# Altium schematic sheet loraModule.SchDoc
size A3
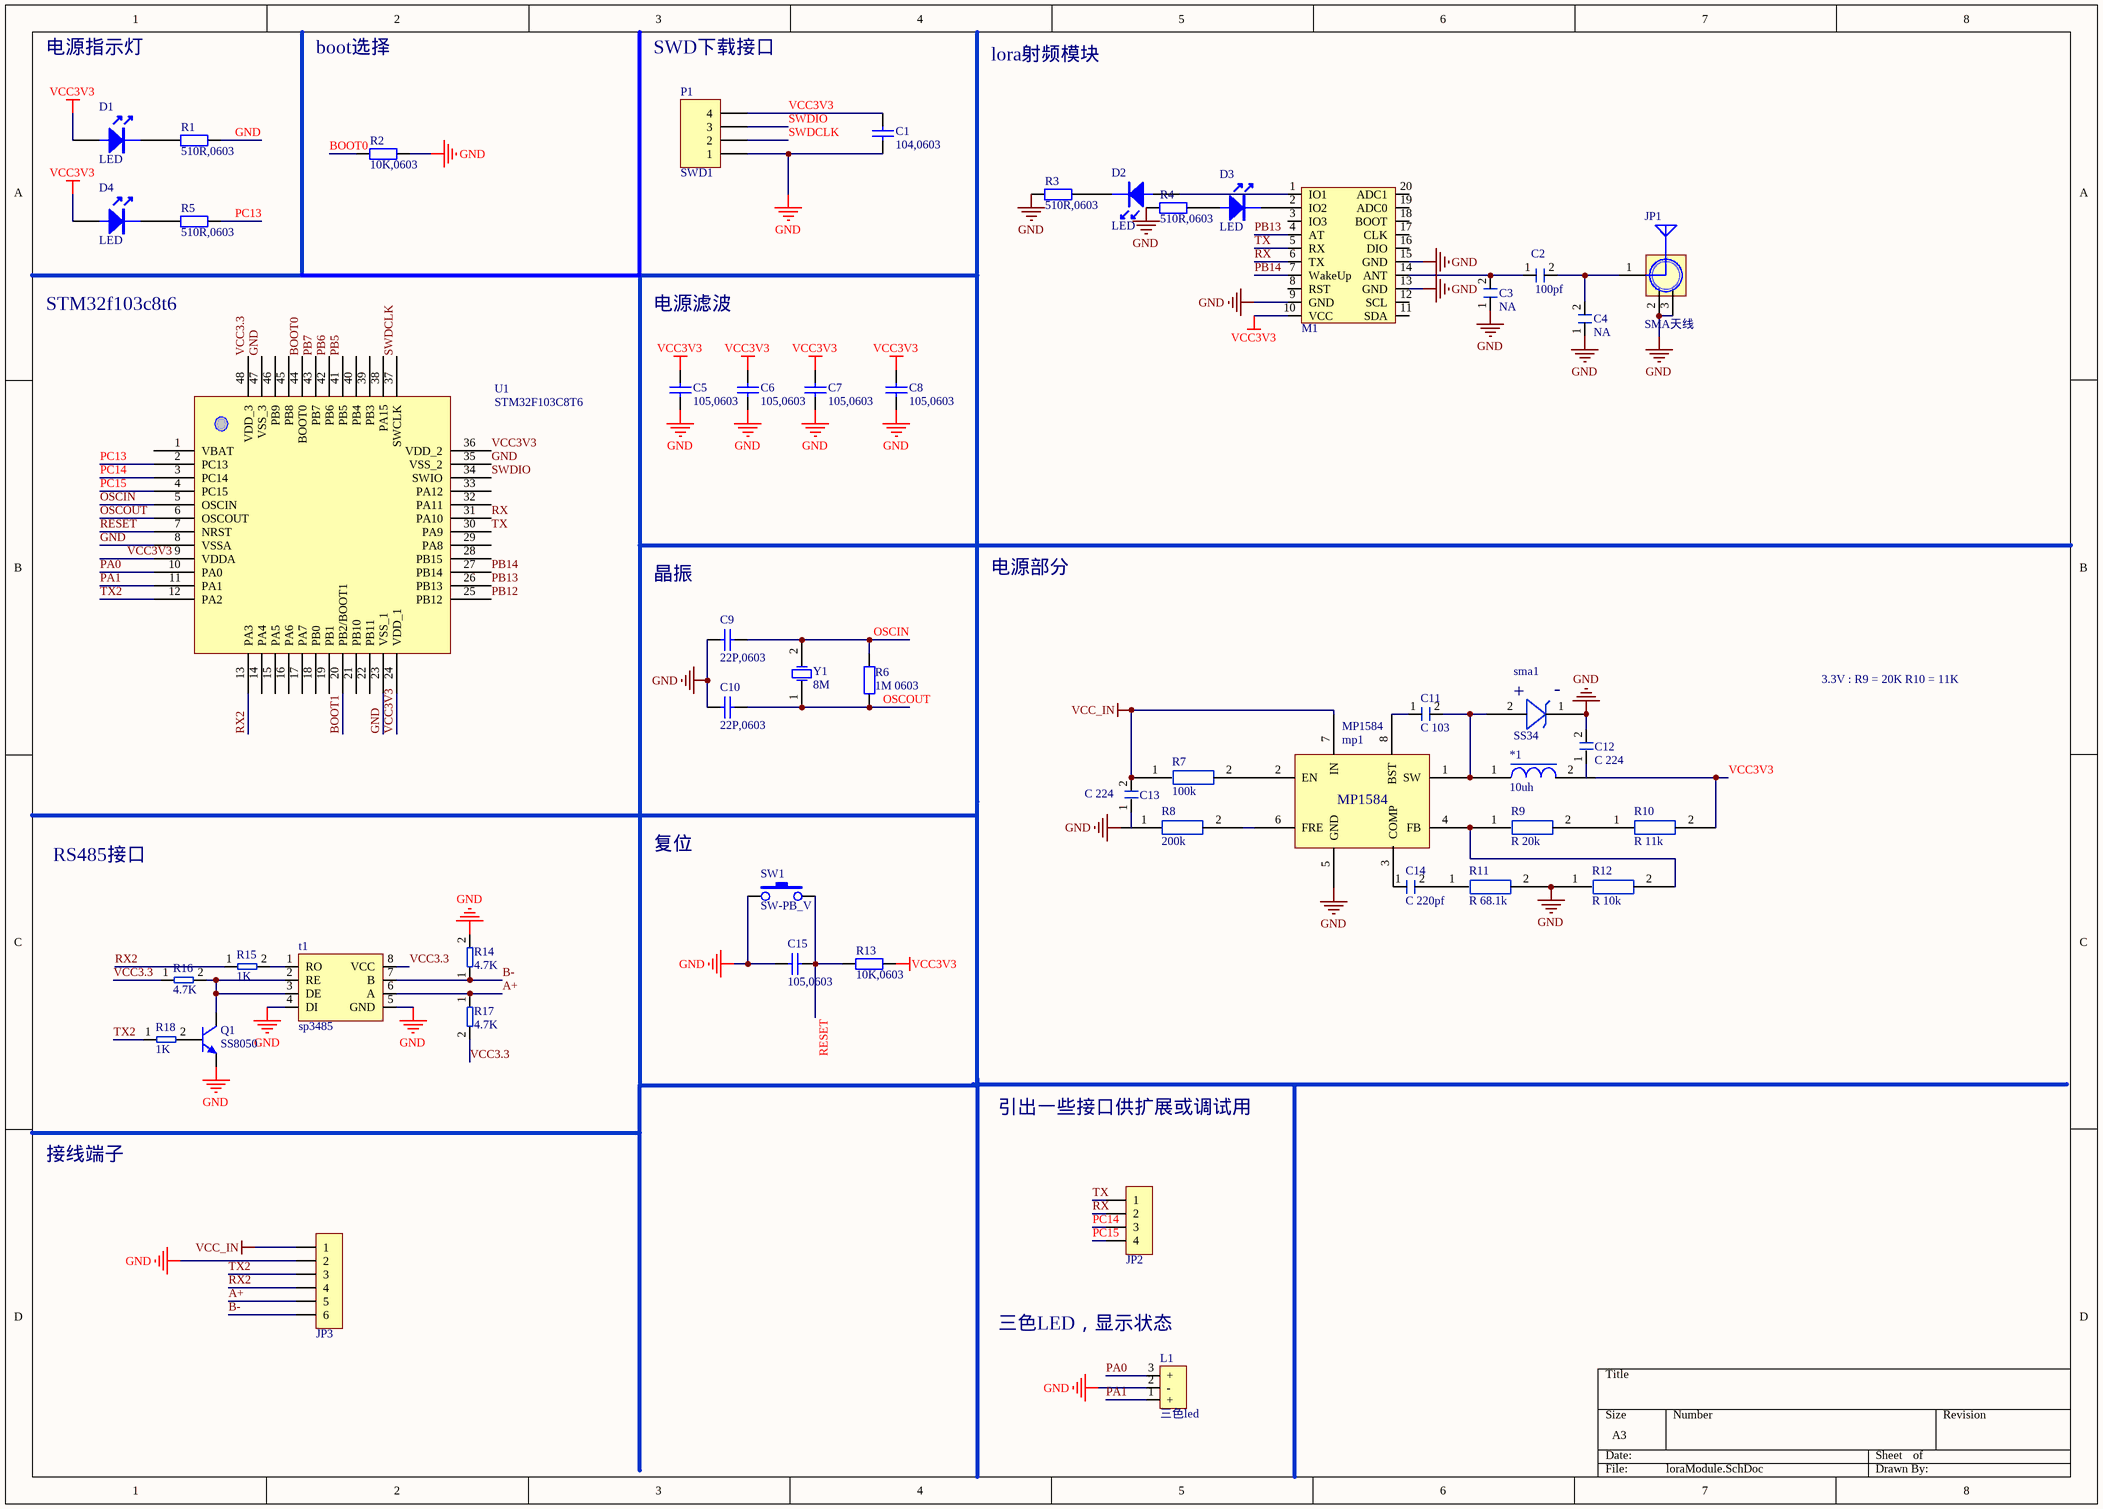
[diagram p0: loraModule.SchDoc]

## Parts
*1  10uh  [inductance]
C1  104,0603  [C 0603]
C2  100pf  [C 0603]
C3  NA  [C 0603]
C4  NA  [C 0603]
C5  105,0603  [C 0603]
C6  105,0603  [C 0603]
C7  105,0603  [C 0603]
C8  105,0603  [C 0603]
C9  22P,0603  [C 0603]
C10  22P,0603  [C 0603]
C11  C 103  [C 0603]
C12  C 224  [C 1206]
C13  C 224  [C 1206]
C14  C 220pf  [C 0603]
C15  105,0603  [C 0603]
D1  LED  [LED 0805G]
D2  LED  [LED 0805G]
D3  LED  [LED 0805G]
D4  LED  [LED 0805G]
JP1  SMA天线  [SMA-KE-LI]
JP2  HDR-1X4  [XH2.54-WI-4P]  (value not drawn)
JP3  HDR-1X6  [XH-3.55]  (value not drawn)
L1  三色led  [三色led - duplicate]
M1  M-HL10  [M-HL10]  (value not drawn)
mp1  MP1584  [mp1584]
P1  SWD1  [HDR-1X4_H]
Q1  SS8050  [SOT-23]
R1  510R,0603  [R 0603]
R2  10K,0603  [R 0603]
R3  510R,0603  [R 0603]
R4  510R,0603  [R 0603]
R5  510R,0603  [R 0603]
R6  1M 0603  [R 0603]
R7  100k  [R 0603]
R8  200k  [R 0603]
R9  R 20k  [R 0603]
R10  R 11k  [R 0603]
R11  R 68.1k  [R 0603]
R12  R 10k  [R 0603]
R13  10K,0603  [R 0603]
R14  4.7K  [R 0805]
R15  1K  [R 0805]
R16  4.7K  [R 0805]
R17  4.7K  [R 0805]
R18  1K  [R 0805]
sma1  SS34  [SMA]
SW1  SW-PB_V  [TSW SMD-3*6*2.5]
t1  sp3485  [sp3485]
U1  STM32F103C8T6  [TQFP48 7x7_L]
Y1  8M  [XTAL-49S DIP]

## Nets
GND: C1.1 C3.1 C4.1 C5.1 C6.1 C7.1 C8.1 C9.2 C10.2 C12.2 C15.1 JP1.2(GND) JP1.3(GND) JP3.2 L1.2(-) M1.9(GND) M1.13(GND) M1.15(GND) mp1.5(GND) P1.1 Q1.2(E) R1.2 R2.2 R3.1 R4.1 R8.1 R11.2 R12.1 R14.2 sma1.1 SW1.1 t1.4(DI) t1.5(GND) U1.8(VSSA) U1.23(VSS_1) U1.35(VSS_2) U1.47(VSS_3)
VCC3V3: *1.2 C1.2 C5.2 C6.2 C7.2 C8.2 D1.1 D4.1 M1.10(VCC) P1.4 R10.2 R13.2 U1.9(VDDA) U1.24(VDD_1) U1.36(VDD_2)
VCC_IN: C13.2 JP3.1 mp1.7(IN) R7.1
A+: JP3.5 R17.1 t1.6(A)
B-: JP3.6 R14.1 t1.7(B)
BOOT0: R2.1 U1.44(BOOT0)
BOOT1: U1.20(PB2/BOOT1)
OSCIN: C9.1 R6.2 U1.5(OSCIN) Y1.2(OSC2)
OSCOUT: C10.1 R6.1 U1.6(OSCOUT) Y1.1(OSC1)
PA0: L1.3(+) U1.10(PA0)
PA1: L1.1(+) U1.11(PA1)
PB5: U1.41(PB5)
PB6: U1.42(PB6)
PB7: U1.43(PB7)
PB12: U1.25(PB12)
PB13: M1.4(AT) U1.26(PB13)
PB14: M1.7(WakeUp) U1.27(PB14)
PC13: R5.2 U1.2(PC13)
PC14: JP2.3 U1.3(PC14)
PC15: JP2.4 U1.4(PC15)
RESET: C15.2 R13.1 SW1.2 U1.7(NRST)
RX: JP2.2 M1.6(TX) U1.31(PA10)
RX2: JP3.4 R15.1 U1.13(PA3)
SWDCLK: P1.2 U1.37(SWCLK)
SWDIO: P1.3 U1.34(SWIO)
TX: JP2.1 M1.5(RX) U1.30(PA9)
TX2: JP3.3 R18.1 U1.12(PA2)
VCC3.3: R16.1 R17.2 t1.8(VCC) U1.48(VDD_3)
Net*1_1: *1.1 C11.2 mp1.1(SW) sma1.2
NetC2_1: C2.1 C3.2 M1.14(ANT)
NetC2_2: C2.2 C4.2 JP1.1(ANT)
NetC11_1: C11.1 mp1.8(BST)
NetC14_1: C14.1 mp1.3(COMP)
NetC14_2: C14.2 R11.1
NetD1_2: D1.2 R1.1
NetD2_1: D2.1 M1.1(IO1)
NetD2_2: D2.2 R3.2
NetD3_2: D3.2 M1.2(IO2)
NetD4_2: D4.2 R5.1
Netmp1_2: mp1.2(EN) R7.2
Netmp1_4: mp1.4(FB) R9.1 R12.2
Netmp1_6: mp1.6(FRE) R8.2
NetQ1_1: Q1.1(B) R18.2
NetQ1_3: Q1.3(C) R16.2 t1.2(RE) t1.3(DE)
NetR9_2: R9.2 R10.1
NetR15_2: R15.2 t1.1(RO)

Not connected (* = marked no-connect by the designer): C12 1; C13 1; D3 1; M1 3(IO3) 8(RST) 11(SDA) 12(SCL) 16(DIO) 17(CLK) 18(BOOT) 19(ADC0) 20(ADC1); R4 2; U1 1(VBAT) 14(PA4) 15(PA5) 16(PA6) 17(PA7) 18(PB0) 19(PB1) 21(PB10) 22(PB11) 28(PB15) 29(PA8) 32(PA11) 33(PA12) 38(PA15) 39(PB3) 40(PB4) 45(PB8) 46(PB9)

## Notes on the sheet
- 电源指示灯
- boot选择
- SWD下载接口
- lora射频模块
- STM32f103c8t6
- 电源滤波
- 晶振
- 电源部分
- 3.3V : R9 = 20K R10 = 11K
- 复位
- RS485接口
- 引出一些接口供扩展或调试用
- 接线端子
- 三色LED，显示状态
- (in symbol s?) +; -

## Library data of the parts
*1 = inductance
C1 C5-C10 C15 = Cap: Capacitor; Value: 104; Published: 8-Jun-2000; LatestRevisionDate: 17-Jul-2002; LatestRevisionNote: Re-released for DXP Platform.; Publisher: Altium Limited
C2-C4 C11 C14 = C 0603
C12 C13 = C 1206
JP1 = SMA: SMA-2.4G射频天线接口; 版权归属: 源创客; BOM名称: SMA-2.4G射频天线接口; 学习资源: www.ooocke.com
JP2 = Header 4: 4P接插件; 版权归属: 源创客; BOM名称: 4P接插件; 学习资源: www.ooocke.com
JP3 = Header 6: 6P接插件; 版权归属: 源创客; BOM名称: 6P接插件; 学习资源: www.ooocke.com
mp1 = M?
P1 = Header 4: Header, 4-Pin; LatestRevisionDate: 17-Jul-2002; LatestRevisionNote: Re-released for DXP Platform.; Publisher: Altium Limited
Q1 = 8050-SMD: 高频放大-NPN型; 版权归属: 源创客; 属性: 40V 1.5A 1W 100MHZ; BOM名称: 高频放大-NPN型; 学习资源: www.ooocke.com
R1-R6 R13 = Res2: Resistor; Published: 8-Jun-2000; LatestRevisionDate: 17-Jul-2002; LatestRevisionNote: Re-released for DXP Platform.; Publisher: Altium Limited
R7 R8 = R?
R9-R12 = R 0603
R14-R18 = R 0805
sma1 = s?
SW1 = SW-PB_V: SWITCH
t1 = transistor
Y1 = XTAL: Crystal Oscillator; Published: 8-Jun-2000; LatestRevisionDate: 17-Jul-2002; LatestRevisionNote: Re-released for DXP Platform.; Publisher: Altium Limited